# EAGLE design SOLAR 13.8V VERSION 2 (EAGLE 9.2.0)
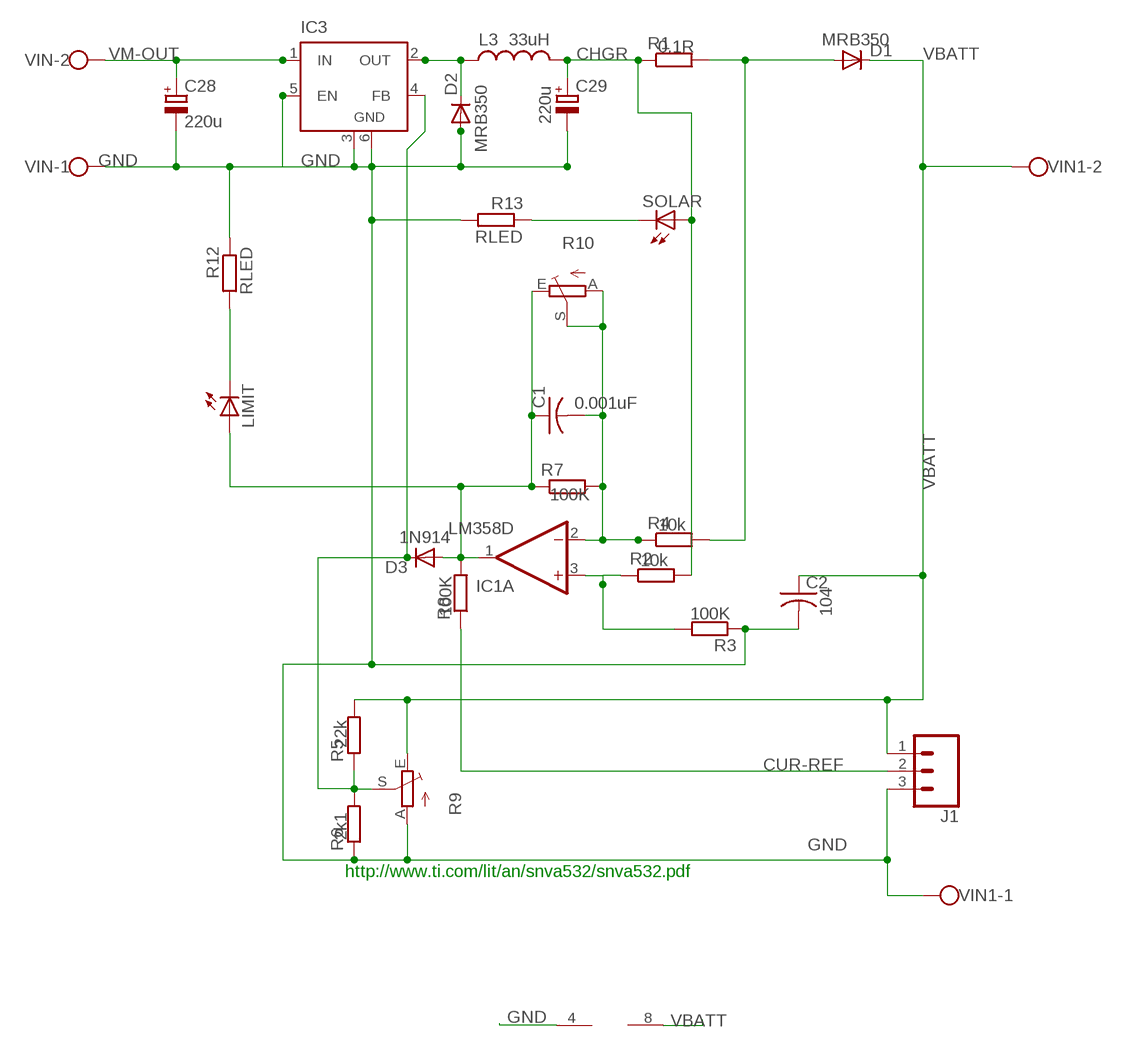
[diagram p0: schematic, sheet 1]

## Parts
C1  0.001uF  C-USC1206  [C1206]
C2  104  C-USC1206  [C1206]
C28  220u  CPOL-EUE3.5-10  [E3,5-10]
C29  220u  CPOL-EUE3.5-10  [E3,5-10]
D1  MRB350  DIODE-DO-214AC  [DO-214AC]
D2  MRB350  DIODE-DO-214AC  [DO-214AC]
D3  1N914  DIODE-DO-214AC  [DO-214AC]
IC1  LM358D  LMV358MX  [SO08]
IC3  LM2596S  [TO263-5]
J1  CONN_03  [1X03]
L3  33uH  INDUCTORPWR  [CDRH125]
LIMIT  LED3MM  [LED3MM]
R1  0.1R  R-EU_R2512  [R2512]
R2  10k  R-EU_R1206  [R1206]
R3  100K  R-EU_R1206  [R1206]
R4  10k  R-EU_R1206  [R1206]
R5  22k  R-EU_R1206  [R1206]
R6  2k1  R-EU_R1206  [R1206]
R7  100K  R-EU_R1206  [R1206]
R8  100K  R-EU_R1206  [R1206]
R9  TRIM_EU-B25P  [B25P]
R10  TRIM_EU-B25P  [B25P]
R12  RLED  R-EU_R1206  [R1206]
R13  RLED  R-EU_R1206  [R1206]
SOLAR  LED3MM  [LED3MM]
VIN  W237-102  [W237-102]
VIN1  W237-102  [W237-102]

## Nets
CHGR: C29.+ L3.2 R1.1 R2.2 SOLAR.A
CUR-REF: J1.2 R8.1
GND: C2.2 C28.- C29.- D2.2(A) IC1.4(P:V-) IC3.3(GND) IC3.5(EN) IC3.6(GND) J1.3 R3.1 R6.1 R9.A R12.1 R13.2 VIN1.1 VIN.1
N$1: D1.2(A) R1.2 R4.2
N$2: IC1.3(A:+IN) R2.1 R3.2
N$3: R13.1 SOLAR.K(C)
N$4: D3.1(C) IC3.4(FB) R5.1 R6.2 R9.S
N$6: C1.1 D3.2(A) IC1.1(A:OUT) LIMIT.A R7.1 R8.2 R10.E
N$7: LIMIT.K(C) R12.2
N$8: C1.2 IC1.2(A:-IN) R4.1 R7.2 R10.A R10.S
N$50: D2.1(C) IC3.2(OUT) L3.1
VBATT: C2.1 D1.1(C) IC1.8(P:V+) J1.1 R5.2 R9.E VIN1.2
VM-OUT: C28.+ IC3.1(IN) VIN.2
Unconnected: IC1.5(B:+IN) IC1.6(B:-IN) IC1.7(B:OUT)

## Notes on the sheet
- http://www.ti.com/lit/an/snva532/snva532.pdf

## Library data of the parts
C1 C2 = rcl:C-US: CAPACITOR, American symbol; SPICEPREFIX: C
C28 C29 = rcl:CPOL-EU: POLARIZED CAPACITOR, European symbol
D1-D3 = dp_devices:DIODE: Various Diode Packages
IC1 = linear:LMV358?*: Dual General Purpose, Low Voltage, Rail-to-Rail Output Operational Amplifiers Source: http://www.national.com/mpf/LM/LMV321.html http://www.national.com/dt/lmv_qual.pdf
IC3 = linear:LM2596S: STEP-DOWN VOLTAGE REGULATOR
J1 = SparkFun-Connectors:CONN_03: Multi connection point. Often used as Generic Header-pin footprint for 0.1 inch spaced/style header connections On any of the 0.1 inch spaced packages, you can populate with these: Break Away Headers - Straight <https://www.sparkfun.com/products/116> (PRT-00116) Break Away Male Headers - Right Angle <https://www.sparkfun.com/products/553> (PRT-00553) Female Headers <https://www.sparkfun.com/products/115> (PRT-00115) Break Away Headers - Machine Pin <https://www.sparkfun.com/products/117> (PRT-00117) Break Away Female Headers - Swiss Machine Pin <https://www.sparkfun.com/products/743> (PRT-00743) Stackable Header - 3 Pin (Female, 0.1") <https://www.sparkfun.com/products/13875> (PRT-13875) For SCREWTERMINALS and SPRING TERMINALS visit here: Screw Terimnals on SparkFun.com <https://www.sparkfun.com/search/results?term=Screw+Terminals> (5mm/3.5mm/2.54mm spacing) This device is also useful as a general connection point to wire up your design to another part of your project. Our various solder wires solder well into these plated through hole pads. Hook-Up Wire - Assortment (Stranded, 22 AWG) <https://www.sparkfun.com/products/11375> (PRT-11375) Hook-Up Wire - Assortment (Solid Core, 22 AWG) <https://www.sparkfun.com/products/11367> (PRT-11367) View the entire wire category on our website here <https://www.sparkfun.com/categories/141> Special notes: Molex polarized connector foot print use with SKU : PRT-08232 with associated crimp pins and housings.
L3 = SparkFun-Passives:INDUCTOR: Inductors Basic Inductor/Choke - 0603 and 1206. Footprints are not proven and vary greatly between part numbers. SRN6045- 33uH, 20% 1.4A SDR0403-560KL - 56uH, 10%, 500mA RMS/740mA peak
LIMIT SOLAR = adafruit:LED: LED OSRAM: - CHIPLED LG R971, LG N971, LY N971, LG Q971, LY Q971, LO R971, LY R971 LH N974, LH R974 LS Q976, LO Q976, LY Q976 LO Q996 - Hyper CHIPLED LW Q18S LB Q993, LB Q99A, LB R99A - SideLED LS A670, LO A670, LY A670, LG A670, LP A670 LB A673, LV A673, LT A673, LW A673 LH A674 LY A675 LS A676, LA A676, LO A676, LY A676, LW A676 LS A679, LY A679, LG A679 - Hyper Micro SIDELED® LS Y876, LA Y876, LO Y876, LY Y876 LT Y87S - SmartLED LW L88C, LW L88S LB L89C, LB L89S, LG L890 LS L89K, LO L89K, LY L89K LS L896, LA L896, LO L896, LY L896 - TOPLED LS T670, LO T670, LY T670, LG T670, LP T670 LSG T670, LSP T670, LSY T670, LOP T670, LYG T670 LG T671, LOG T671, LSG T671 LB T673, LV T673, LT T673, LW T673 LH T674 LS T676, LA T676, LO T676, LY T676, LB T676, LH T676, LSB T676, LW T676 LB T67C, LV T67C, LT T67C, LS T67K, LO T67K, LY T67K, LW E67C LS E67B, LA E67B, LO E67B, LY E67B, LB E67C, LV E67C, LT E67C LW T67C LS T679, LY T679, LG T679 LS T770, LO T770, LY T770, LG T770, LP T770 LB T773, LV T773, LT T773, LW T773 LH T774 LS E675, LA E675, LY E675, LS T675 LS T776, LA T776, LO T776, LY T776, LB T776 LHGB T686 LT T68C, LB T68C - Hyper Mini TOPLED® LB M676 - Mini TOPLED Santana® LG M470 LS M47K, LO M47K, LY M47K Source: http://www.osram.convergy.de/
R1-R8 R12 R13 = rcl:R-EU_: RESISTOR, European symbol; SPICEPREFIX: R
R9 R10 = pot:TRIM_EU-: POTENTIOMETER
VIN VIN1 = con-wago-500:W237-102: WAGO SCREW CLAMP; MPN: 237-102; OC_FARNELL: unknown; OC_NEWARK: 70K9898

## Net classes
1 Power: width 0.305 mm

## Board
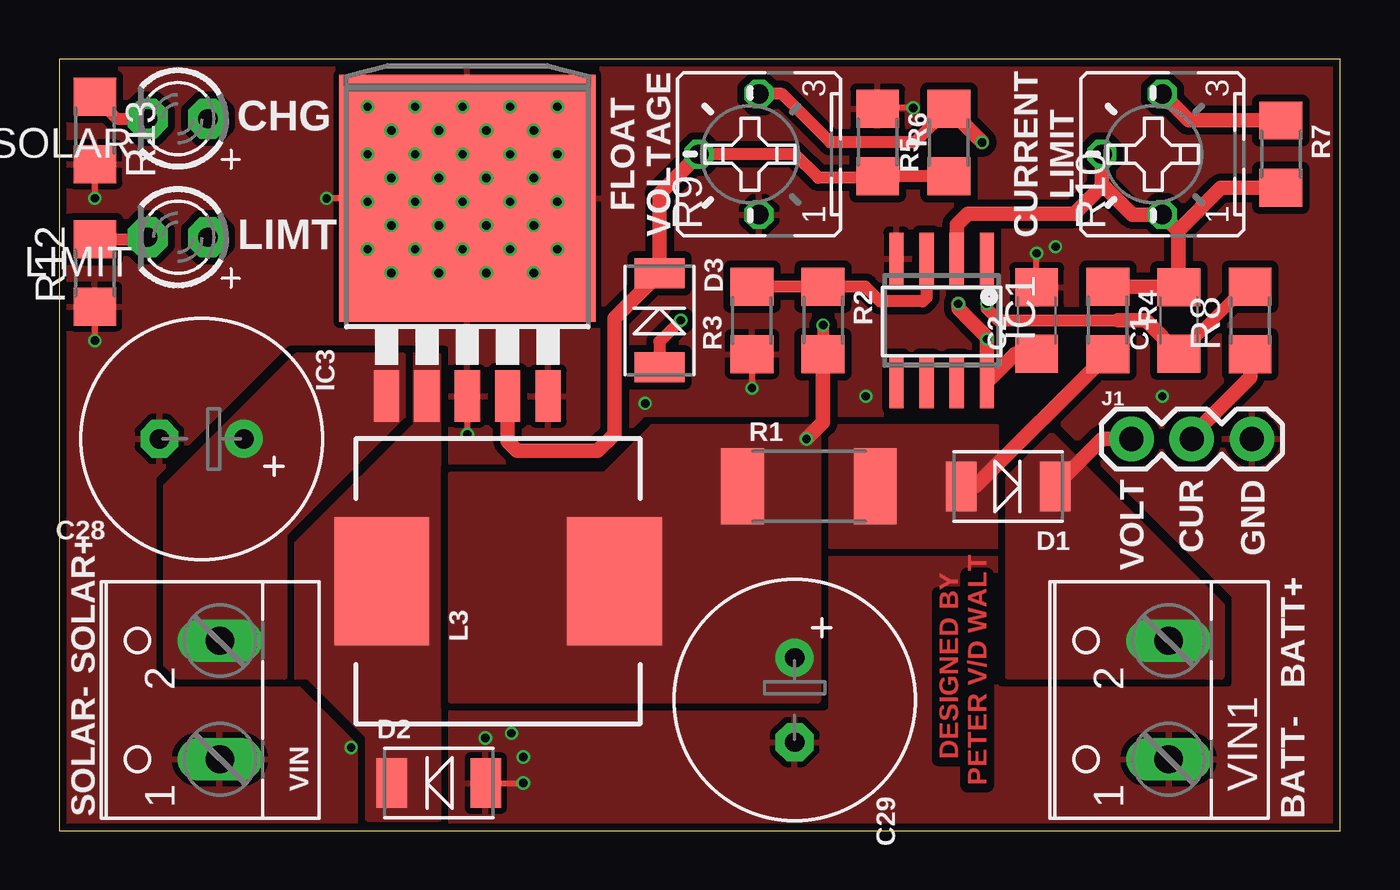
[diagram p1: board, top side]
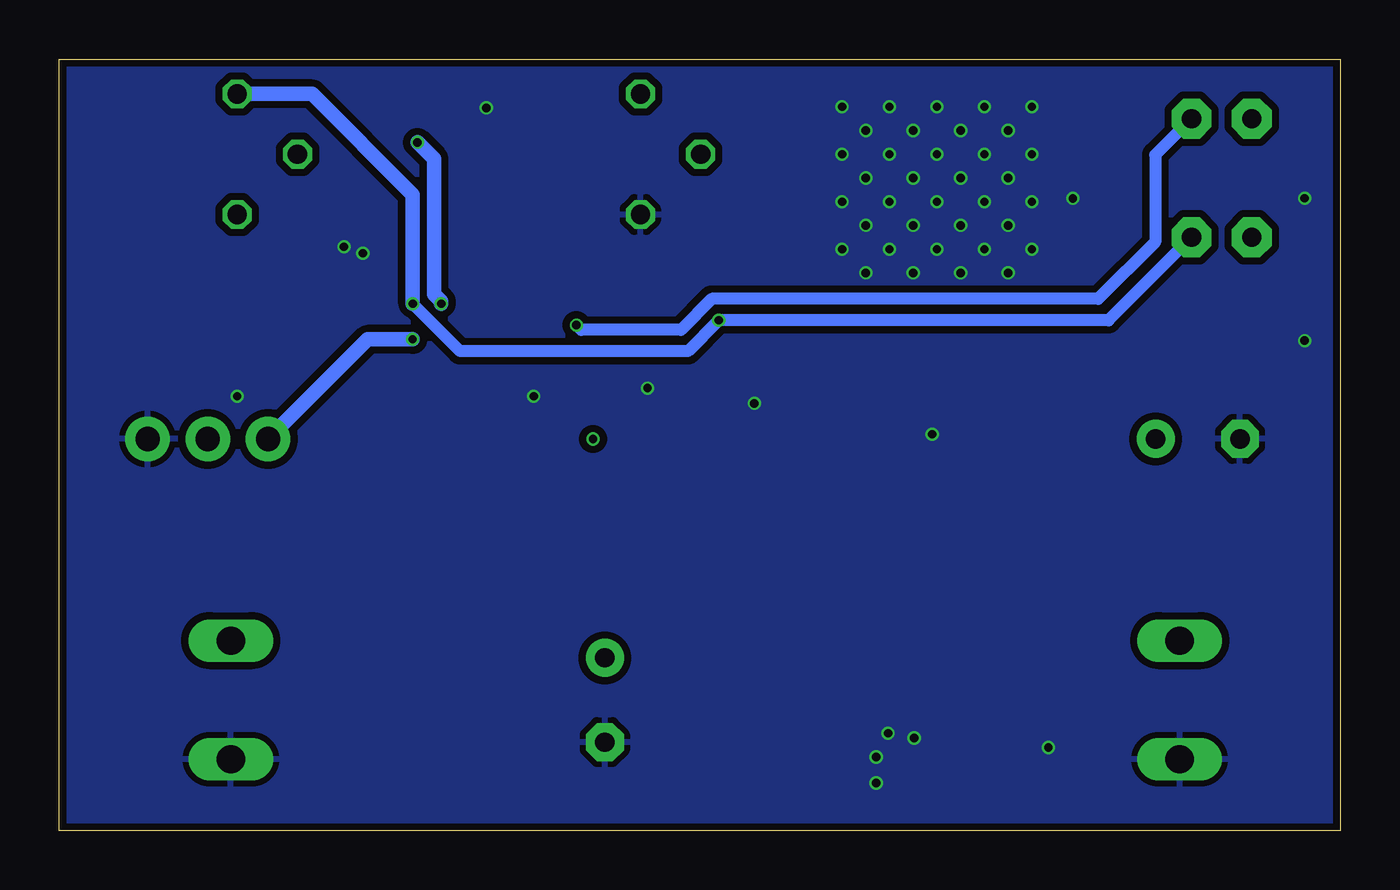
[diagram p2: board, bottom side, seen from below]

Size 54 x 32.5 mm. Coordinates in mm from the lower left corner, seen from the top.
Outline: 0,0 54,0 54,32.5 0,32.5 0,0
Copper layers (1*16): Top 0.035mm / dielectric 0.2mm / Bottom 0.035mm
Design rules "SeeedStudio_4layer_DRU_no_angle_20140221 *": minimum track width 8mil, minimum drill 12mil, track to track 8mil, track to pad 8mil, pad to pad 8mil, via to via 8mil, smd to smd 0mil, copper to edge 10mil, drill to drill 8mil, minimum pad ring 6mil, minimum via ring 4mil, stop-mask expansion 4mil, vias tented up to drill 25mil, thermal gap 10mil

### Footprints (pad centres in the part's own frame; a part is rotated, then mirrored left to right if it is on the bottom)
C1206 = smd 1.6 x 1.8: 1 -1.4,0; 2 1.4,0
E3,5-10 = drill 0.813 pad 1.6: + -1.778,0 | drill 0.813 pad 1.6 octagon: - 1.778,0
DO-214AC = smd 1.27 x 2.1: 1 -1.98,0; 2 1.98,0
SO08 = smd 0.6 x 2.2: 1 -1.905,-2.6; 2 -0.635,-2.6; 3 0.635,-2.6; 4 1.905,-2.6; 5 1.905,2.6; 6 0.635,2.6; 7 -0.635,2.6; 8 -1.905,2.6
TO263-5 = smd 1.067 x 2.159: 1 -3.404,-5.791; 2 -1.702,-5.791; 3 0,-5.791; 4 1.702,-5.791; 5 3.404,-5.791 | smd 10.8 x 10.41: 6 0,2.54
1X03 = drill 1.016 pad 1.88: 1 0,0; 2 2.54,0; 3 5.08,0
CDRH125 = smd 5.4 x 4: 1 0,4.9; 2 0,-4.9
LED3MM = drill 0.813 pad 1.676 octagon: A -1.27,0; K 1.27,0
R2512 = smd 1.8 x 3.2: 1 -2.8,0; 2 2.8,0
R1206 = smd 1.6 x 1.803: 1 -1.422,0; 2 1.422,0
B25P = drill 0.813 octagon: A -2.54,0; E 2.54,0; S 0,2.54
W237-102 = drill 1.194 long: 1 -2.5,-1.27; 2 2.5,-1.27

### Placement (x,y rotation side)
C1  47.2,21.5 90 top
C2  41.2,21.5 90 top
C28  6,16.5 180 top
C29  31,5.5 270 top
D1  40,14.5 180 top
D2  16,2 0 top
D3  25.3,21.5 270 top
IC1  37.2,21.5 180 top
IC3  17.2,24.1 0 top
J1  45.2,16.5 0 top
L3  18.5,10.5 90 top
LIMIT  5,25 180 top
R1  31.6,14.5 0 top
R2  32.2,21.5 270 top
R3  29.2,21.5 90 top
R4  44.2,21.5 270 top
R5  37.5,29 90 top
R6  34.5,29 270 top
R7  51.5,28.5 270 top
R8  50.2,21.5 90 top
R9  29.5,28.5 90 top
R10  46.5,28.5 90 top
R12  1.5,23.5 90 top
R13  1.5,29.5 270 top
SOLAR  5,30 180 top
VIN  5.5,5.5 90 top
VIN1  45.5,5.5 90 top

### Tracks (layer width: path | path; a pad name or v marks a point on that pad's centre or on a via)
CHGR  (via drill 0.35)
  Top 0.508: v32.2,21.3 R2.2
  Top 0.61: R2.2 32.2,17.2 v31.5,16.5
  Bottom 0.508: SOLAR.A 7.8,28.47 7.8,24.8 10.2,22.4 26.5,22.4 27.8,21.1 32,21.1 v32.2,21.3
  pour Top (isolate 0.305, no thermals): 16.5,15 16.5,5.5 32,5.5 32,17 25,17 23,15
CUR-REF
  Top 0.61: J1.2 47.74,16.64 50.2,19.1 R8.1
GND  (via drill 0.35)
  Top 0.254: IC3.3 v17.2,16.7 | IC3.6 v11.27,26.64 | D2.2 v19.56,2 | R3.1 v29.2,18.65 | v36,30.45 34.53,30.45 R6.1 | C2.2 v41.2,24.33 | R12.1 v1.5,20.65 | R13.2 v1.5,26.65
  other vias: 42,24.6 24.7,18 12.3,3.5 18,23.5 16,23.5 14,23.5 14,25.5 16,25.5 18,25.5 20,25.5 20,23.5 20,27.5 18,27.5 16,27.5 14,27.5 14,29.5 16,29.5 18,29.5 20,29.5 19,28.5 17,28.5 15,28.5 15,26.5 15,24.5 17,24.5 17,26.5 19,26.5 19,24.5 15,30.5 17,30.5 19,30.5 21,28.5 21,26.5 21,24.5 21,30.5 13,28.5 13,30.5 13,26.5 13,24.5 34,18.3 46.5,18.3 19.56,3.1 17.96,3.9 19.06,4.1
  pour Top (isolate 0.305, rank 6): -0.1,32.5 54,32.5 54.1,32.4 54.1,0.1 54,0 0.1,0 0,0.1 0,32.4
  pour Bottom (isolate 0.305, rank 6): -0.1,32.5 54,32.5 54.1,32.4 54.1,0.1 54,0 0.1,0 0,0.1 0,32.4
N$1
  Top 0.61: R4.2 38.62,14.5 D1.2
  pour Top (isolate 0.305, rank 2, no thermals): 33,17 32.5,17 32.5,12.5 32.5,12 39.5,12 39.5,16.5 39.5,17
N$2
  Top 0.508: R3.2 R2.1 33.98,22.92 34.6,22.3 36.4,22.3 36.56,22.46 IC1.3
N$3
  Top 0.508: R13.1 2.42,30 SOLAR.K
N$4
  Top 0.508: R9.S 31,28.5 32,27.5 34.42,27.5 R6.2 R5.1
  Top 0.61: R9.S 25.3,26.84 D3.1 23.4,21.58 23.4,16.7 22.7,16 19.3,16 18.9,16.4 IC3.4
N$6  (via drill 0.35)
  Top 0.508: IC1.1 v39.1,22.2 39.1,22 39.6,21.5 44.62,21.5 | C1.1 50.02,22.92 R8.2 | D3.2 25.3,20.6 v26.2,21.5
  Top 0.61: R7.1 47.62,29.92 R10.E | 44.62,21.5 45.8,21.5 C1.1
  Bottom 0.508: LIMIT.A 9.77,21.5 v26.2,21.5 27.5,20.2 37.1,20.2 v39.1,22.2
  Bottom 0.61: v39.1,22.2 39.1,26.8 43.34,31.04 R10.E
N$7
  Top 0.508: R12.2 3.65,24.92 LIMIT.K
N$8
  Top 0.61: IC1.2 37.84,25.54 38.3,26 42.8,26 44,27.2 | 44,27.2 43.96,27.24 R10.S | 44,27.2 45.24,25.96 R10.A 47.18,25.28 | R4.1 47.18,22.92 | 47.18,22.92 C1.2 | 47.18,25.28 47.18,22.92 | 47.18,25.28 48.97,27.08 R7.2
N$50
  pour Top (isolate 0.305, rank 2, no thermals): 14.5,20 14.5,17.5 9.5,12.5 9.5,6.5 10.5,6.5 13,4 13,0.5 16,0.5 16,20
VBATT  (via drill 0.35)
  Top 0.508: R9.E 30.46,31.04 32.5,29 36.08,29 R5.2
  Top 0.61: C2.1 40.3,20.1 IC1.8 v39.1,20.7 39.1,20.79 38.39,21.5 38.39,21.51 37.9,22 v37.9,22.2 | D1.1 43.98,16.5 J1.1 | v38.9,29 38.9,29.02 R5.2
  Bottom 0.61: v37.9,22.2 37.9,22.3 38.2,22.6 38.2,28.3 v38.9,29 | v39.1,20.7 41,20.7 J1.1
  pour Top (isolate 0.305, no thermals): 40,17 40,12 40,6.5 49,6.5 49,9.5 41.5,17
VM-OUT
  pour Top (isolate 0.305, no thermals): 14.5,19 14.5,20 10,20 6,16 4.5,14.5 4.5,7 5,6.5 9.5,6.5 9.5,12.5 14.5,17.5

### Text on the board
Top: DESIGNED BY | PETER V/D WALT
tPlace: CHG | FLOAT / VOLTAGE | CURRENT / LIMIT | LIMT | VOLT | CUR | GND | SOLAR+ | BATT+ | SOLAR- | BATT-